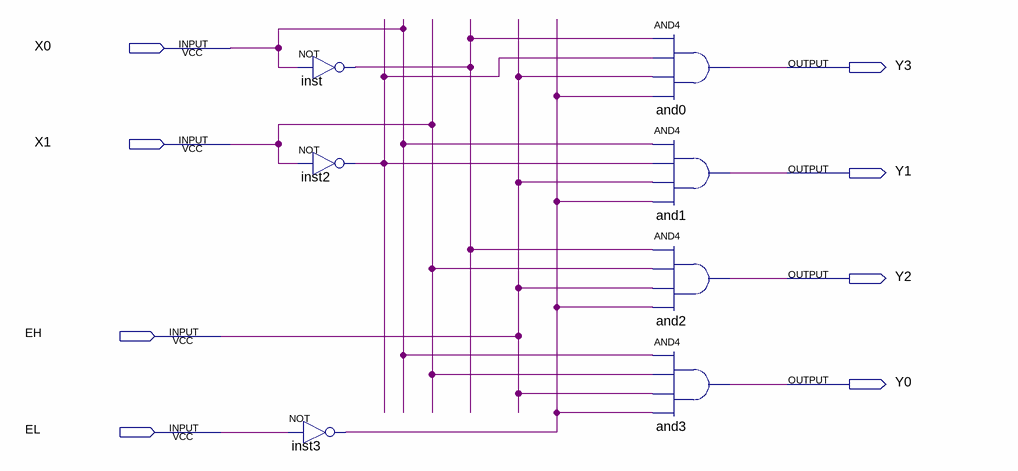
[diagram p0: schematic sheet]
// Quartus schematic Dec2_4.bdf as structural Verilog: 7 symbols, 8 pins
module Dec2_4 (
  input  X0,
  input  X1,
  input  EH,
  input  EL,
  output Y3,
  output Y1,
  output Y2,
  output Y0
);

  wire inst2_out, inst3_out, inst_out;

  not inst (inst_out, X0);
  not inst2 (inst2_out, X1);
  not inst3 (inst3_out, EL);
  and and0 (Y3, inst_out, inst2_out, EH, inst3_out);
  and and1 (Y1, X0, inst2_out, EH, inst3_out);
  and and2 (Y2, inst_out, X1, EH, inst3_out);
  and and3 (Y0, X0, X1, EH, inst3_out);
endmodule
